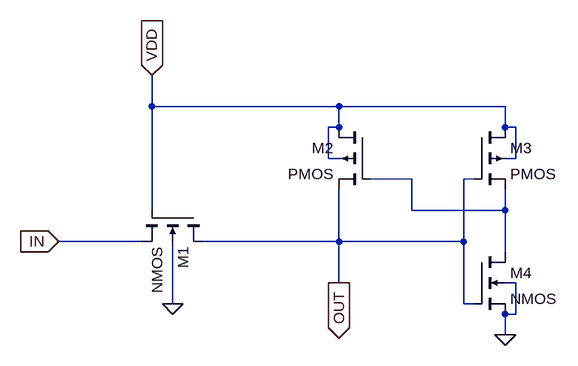
[diagram p0: schematic LevelRestorerCkt.asc]
LevelRestorerCkt.asc, the LTspice schematic file:
Version 4
SHEET 1 880 680
WIRE 208 -64 208 -112
WIRE 496 -64 208 -64
WIRE 752 -64 496 -64
WIRE 496 -32 496 -64
WIRE 496 -32 480 -32
WIRE 752 -32 752 -64
WIRE 768 -32 752 -32
WIRE 480 16 480 -32
WIRE 496 16 480 16
WIRE 768 16 768 -32
WIRE 768 16 752 16
WIRE 608 48 544 48
WIRE 704 48 688 48
WIRE 208 96 208 -64
WIRE 608 96 608 48
WIRE 752 96 752 64
WIRE 752 96 608 96
WIRE 192 144 64 144
WIRE 496 144 496 64
WIRE 496 144 288 144
WIRE 688 144 688 48
WIRE 688 144 496 144
WIRE 752 160 752 96
WIRE 496 208 496 144
WIRE 768 208 752 208
WIRE 240 240 240 144
WIRE 688 240 688 144
WIRE 704 240 688 240
WIRE 768 256 768 208
WIRE 768 256 752 256
WIRE 752 288 752 256
FLAG 64 144 IN
IOPIN 64 144 In
FLAG 208 -112 VDD
IOPIN 208 -112 In
FLAG 240 240 0
FLAG 752 288 0
FLAG 496 208 OUT
IOPIN 496 208 Out
SYMBOL nmos4 288 96 R90
SYMATTR InstName M1
SYMATTR Value2 l=65nm w=65nm
SYMBOL pmos4 544 -32 M0
SYMATTR InstName M2
SYMATTR Value2 l=65nm w=162.5nm
SYMBOL pmos4 704 -32 R0
SYMATTR InstName M3
SYMATTR Value2 l=65nm w=65nm
SYMBOL nmos4 704 160 R0
SYMATTR InstName M4
SYMATTR Value2 l=65nm w=65nm

The netlist it stands for:
* LevelRestorerCkt.asc
M1 OUT VDD IN 0 NMOS l=65nm w=65nm
M2 VDD N001 OUT VDD PMOS l=65nm w=162.5nm
M3 VDD OUT N001 VDD PMOS l=65nm w=65nm
M4 N001 OUT 0 0 NMOS l=65nm w=65nm
.model NMOS NMOS
.model PMOS PMOS
.lib standard.mos
.backanno
.end